# EAGLE design TidePod (EAGLE 9.0.0)
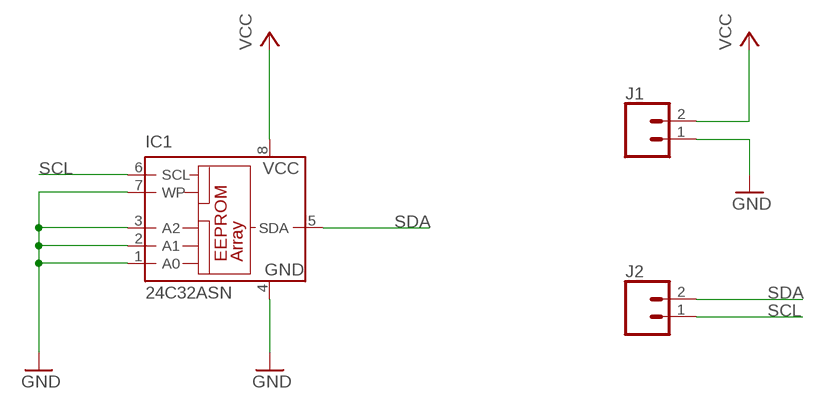
[diagram p0: schematic, sheet 1]

## Parts
IC1  24C32ASN  [SO-08]
J1  CONN_021X02_NO_SILK  [1X02_NO_SILK]
J2  CONN_021X02_NO_SILK  [1X02_NO_SILK]

## Nets
GND: IC1.1(A0) IC1.2(A1) IC1.3(A2) IC1.4(GND) IC1.7(WP) J1.1
SCL: IC1.6(SCL) J2.1
SDA: IC1.5(SDA) J2.2
VCC: IC1.8(VCC) J1.2

## Library data of the parts
IC1 = microchip:24*: Serial EEPROM I2C; MPN: IS24C32A-2GLI; OC_FARNELL: 1224413; OC_NEWARK: 43M4588
J1 J2 = SparkFun-Connectors:CONN_02: Multi connection point. Often used as Generic Header-pin footprint for 0.1 inch spaced/style header connections On any of the 0.1 inch spaced packages, you can populate with these: Break Away Headers - Straight <https://www.sparkfun.com/products/116> (PRT-00116) Break Away Male Headers - Right Angle <https://www.sparkfun.com/products/553> (PRT-00553) Female Headers <https://www.sparkfun.com/products/115> (PRT-00115) Break Away Headers - Machine Pin <https://www.sparkfun.com/products/117> (PRT-00117) Break Away Female Headers - Swiss Machine Pin <https://www.sparkfun.com/products/743> (PRT-00743) For SCREWTERMINALS and SPRING TERMINALS visit here: Screw Terimnals on SparkFun.com <https://www.sparkfun.com/search/results?term=Screw+Terminals> (5mm/3.5mm/2.54mm spacing) This device is also useful as a general connection point to wire up your design to another part of your project. Our various solder wires solder well into these plated through hole pads. Hook-Up Wire - Assortment (Stranded, 22 AWG) <https://www.sparkfun.com/products/11375> (PRT-11375) Hook-Up Wire - Assortment (Solid Core, 22 AWG) <https://www.sparkfun.com/products/11367> (PRT-11367) View the entire wire category on our website here <https://www.sparkfun.com/categories/141> Special notes: Molex polarized connector foot print use with: PRT-08233 with associated crimp pins and housings. 2.54_SCREWTERM for use with PRT-10571. 3.5mm Screw Terminal footprints for PRT-08084 5mm Screw Terminal footprints for use with PRT-08432

## Board
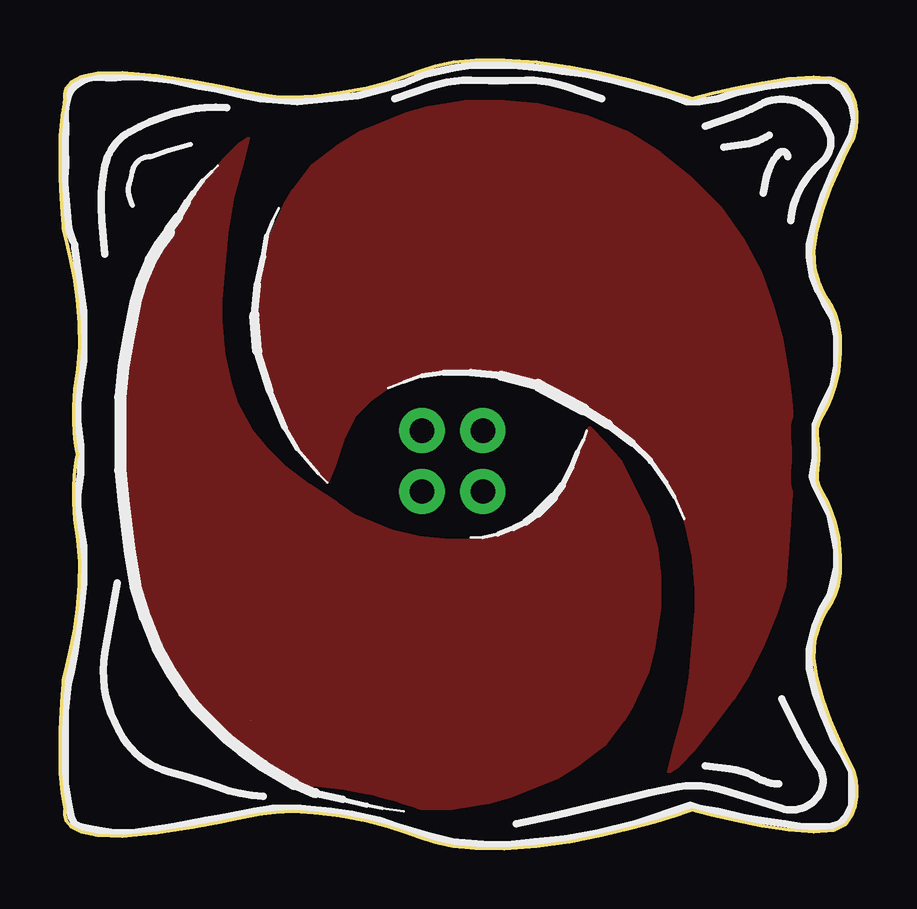
[diagram p1: board, top side]
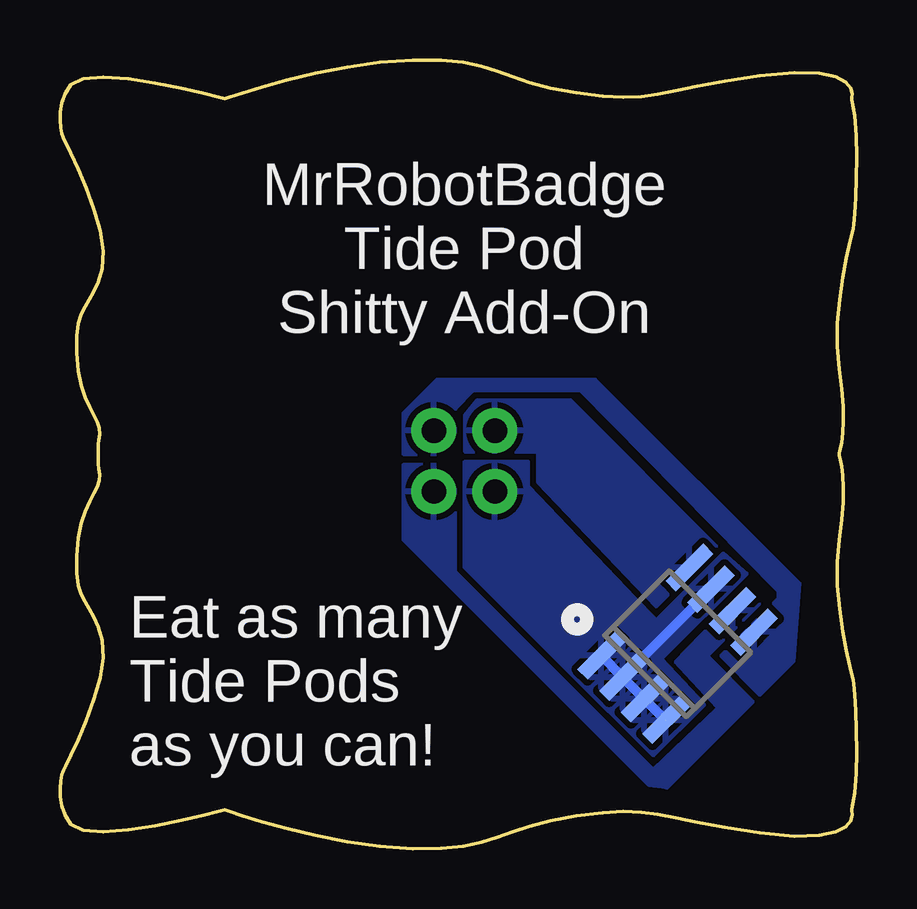
[diagram p2: board, bottom side, seen from below]

Size 33.2 x 32.88 mm. Coordinates in mm from the lower left corner, seen from the top.
Outline: 31.6,16.44 31.6,16.45 31.61,16.47 31.61,16.52 31.61,16.6 31.61,16.71 31.6,16.85 31.58,17.04 31.55,17.28 31.56,17.53 31.64,17.79 31.79,18.08 31.96,18.41 32.14,18.82 32.31,19.31 32.44,19.92 32.51,20.67 32.5,21.38 32.43,21.9 32.31,22.29 32.15,22.6 31.97,22.89 31.79,23.22 31.61,23.63 31.45,24.19 31.4,24.92 31.53,25.77 31.78,26.66 32.1,27.54 32.44,28.34 32.75,28.99 32.97,29.42 33.05,29.59 33.07,29.64 33.12,29.8 33.17,30.05 33.2,30.36 33.19,30.71 33.13,31.09 32.99,31.48 32.74,31.85 32.24,32.11 31.4,32.17 30.36,32.09 29.24,31.92 28.15,31.71 27.22,31.49 26.58,31.33 26.34,31.27 26.15,31.33 25.62,31.5 24.8,31.75 23.76,32.03 22.56,32.32 21.24,32.58 19.87,32.78 18.5,32.88 17.32,32.87 16.39,32.78 15.64,32.62 14.99,32.42 14.34,32.18 13.63,31.94 12.77,31.71 11.68,31.51 10.59,31.37 9.72,31.33 8.99,31.36 8.29,31.45 7.54,31.6 6.64,31.78 5.51,31.99 4.04,32.22 2.6,32.35 1.57,32.33 0.88,32.18 0.47,31.96 0.26,31.71 0.19,31.48 0.2,31.3 0.22,31.24 0.09,30.55 0.02,29.73 0,28.84 0.01,27.95 0.05,27.14 0.09,26.47 0.13,26.01 0.14,25.85 0.18,25.69 0.29,25.27 0.43,24.62 0.58,23.81 0.72,22.89 0.81,21.92 0.82,20.93 0.74,20 0.63,19.16 0.57,18.44 0.57,17.83 0.59,17.33 0.63,16.94 0.68,16.66 0.72,16.5 0.74,16.44 0.72,16.39 0.68,16.22 0.63,15.94 0.59,15.55 0.57,15.05 0.57,14.44 0.63,13.72 0.74,12.88 0.82,11.95 0.81,10.97 0.72,9.99 0.58,9.07 0.43,8.26 0.29,7.61 0.18,7.19 0.14,7.03 0.13,6.87 0.09,6.41 0.05,5.75 0.01,4.93 0,4.04 0.02,3.15 0.09,2.33 0.22,1.65 0.2,1.58 0.19,1.41 0.26,1.17 0.47,0.92 0.88,0.7 1.57,0.56 2.6,0.53 4.04,0.66 5.51,0.89 6.64,1.1 7.54,1.28 8.29,1.43 8.99,1.52 9.72,1.55 10.59,1.51 11.68,1.37 12.77,1.17 13.63,0.94 14.34,0.7 14.99,0.47 15.64,0.26 16.39,0.1 17.32,0.01 18.5,0 19.87,0.1 21.24,0.3 22.56,0.56 23.76,0.85 24.8,1.13 25.62,1.38 26.15,1.55 26.34,1.61 26.58,1.55 27.22,1.39 28.15,1.18 29.24,0.96 30.36,0.79 31.4,0.71 32.24,0.78 32.74,1.03 32.99,1.4 33.13,1.79 33.19,2.17 33.2,2.52 33.17,2.83 33.12,3.08 33.07,3.24 33.05,3.3 32.97,3.46 32.75,3.9 32.44,4.55 32.1,5.34 31.78,6.22 31.53,7.12 31.4,7.96 31.45,8.69 31.61,9.25 31.79,9.66 31.97,9.99 32.15,10.28 32.31,10.59 32.43,10.98 32.5,11.51 32.51,12.21 32.44,12.96 32.31,13.57 32.14,14.07 31.96,14.47 31.79,14.8 31.64,15.09 31.56,15.35 31.55,15.61 31.58,15.84 31.6,16.03 31.61,16.17 31.61,16.28 31.61,16.36 31.61,16.41 31.6,16.43 31.6,16.44
Copper layers (1*16): Top 0.035mm / dielectric 1.5mm / Bottom 0.035mm
Design rules "default": minimum track width 6mil, minimum drill 0.35mm, track to track 6mil, track to pad 6mil, pad to pad 6mil, via to via 6mil, smd to smd 6mil, copper to edge 40mil, drill to drill 6mil, minimum pad ring 10mil, minimum via ring 8mil, stop-mask expansion 4mil, vias tented up to drill 0mil, thermal gap 10mil
Milling: 208 lines

### Footprints (pad centres in the part's own frame; a part is rotated, then mirrored left to right if it is on the bottom)
SO-08 = smd 0.6 x 2.2: 1 -1.905,-2.6; 2 -0.635,-2.6; 3 0.635,-2.6; 4 1.905,-2.6; 5 1.905,2.6; 6 0.635,2.6; 7 -0.635,2.6; 8 -1.905,2.6
1X02_NO_SILK = drill 1.016 pad 1.88: 1 0,0; 2 2.54,0

### Placement (x,y rotation side)
IC1  7.46,8.54 315 bottom
J1  15.08,14.89 90 top
J2  17.62,14.89 90 top

### Tracks (layer width: path | path; a pad name or v marks a point on that pad's centre or on a via)
GND  (1 unrouted)
  Bottom 0.406: IC1.4 IC1.3 IC1.2 | IC1.2 IC1.1 | IC1.7 IC1.2
  pour Bottom: 5.56,12.35 8.35,9.56 9.24,10.45 12.16,7.52 8.48,3.84 6.32,6 8.1,7.91 4.54,11.46
  pour Bottom: 12.16,7.52 16.35,11.72 16.35,16.16 13.69,16.16 13.69,15.14 9.24,10.45
N$1
  pour Top: 22.07,17.56 22.7,16.92 23.34,16.16 23.97,14.89 24.48,13.87 24.86,12.48 24.99,11.33 24.99,10.06 24.73,8.41 24.48,7.4 23.85,6 23.46,5.37 22.7,4.35 21.69,3.59 20.67,2.95 18.77,2.19 17.88,1.94 16.35,1.68 14.7,1.68 13.3,1.81 11.27,2.32 9.62,2.95 8.22,3.84 6.95,4.86 6.19,5.62 5.68,6.13 4.8,7.4 4.03,8.79 3.53,10.19 3.14,11.59 2.89,13.11 2.76,14.13 2.64,15.65 2.64,17.18 2.76,18.32 2.89,20.22 3.02,21.88 3.4,23.02 3.91,24.29 4.54,25.56 5.18,26.57 5.94,27.59 6.83,28.73 7.46,29.37 7.84,29.62 7.59,28.61 7.21,27.21 6.95,25.69 6.83,24.29 6.7,22.89 6.7,22 6.83,20.61 7.08,19.46 7.34,18.57 7.97,17.43 8.61,16.67 9.37,15.91 10.38,15.14 11.53,14.38 12.29,13.87 13.81,13.24 14.96,12.99 16.23,12.86 17.24,12.86 18.38,13.11 19.4,13.49 20.29,14.13 20.92,14.76 21.43,15.78 21.81,16.92
N$2
  pour Top: 11.15,15.27 10.51,15.91 9.88,16.67 8.73,18.95 8.35,20.35 8.22,21.49 8.22,22.76 8.48,24.42 8.73,25.43 9.37,26.83 9.75,27.46 10.51,28.48 11.53,29.24 12.54,29.88 14.45,30.64 15.34,30.89 16.86,31.15 18.51,31.15 19.91,31.02 21.94,30.51 23.59,29.88 24.99,28.99 26.26,27.97 27.53,26.7 28.42,25.43 29.18,24.03 29.69,22.64 30.07,21.24 30.32,19.72 30.45,18.7 30.58,17.18 30.58,15.65 30.45,14.51 30.32,12.6 30.2,10.95 29.81,9.81 29.31,8.54 28.67,7.27 28.04,6.25 27.27,5.24 26.39,4.1 25.75,3.46 25.37,3.21 25.62,4.22 26,5.62 26.26,7.14 26.51,9.94 26.51,10.83 26.39,12.22 26.13,13.37 25.88,14.26 25.24,15.4 24.61,16.16 23.85,16.92 22.83,17.68 20.92,18.95 19.4,19.59 18.26,19.84 16.99,19.97 15.97,19.97 14.83,19.72 13.81,19.34 12.92,18.7 12.29,18.07 11.78,17.05 11.4,15.91
SCL
  pour Bottom: 4.29,11.21 3.65,10.57 6.19,8.03 4.29,6.13 8.22,2.19 18.89,12.86 18.89,16.03 16.73,16.03 16.73,11.59 8.48,3.33 5.81,5.87 7.59,7.78
SDA
  Bottom 0.406: 18.13,17.43 J2.2
  pour Bottom: 18.89,16.41 18.89,18.19 17.5,19.59 10.89,19.59 2.38,11.08 2.64,7.78 4.03,6.38 5.68,8.03 3.27,10.45 3.27,10.7 11.53,19.08 15.97,19.08 16.73,18.32 16.73,16.41
VCC
  pour Bottom: 5.81,12.6 11.91,18.7 15.84,18.7 16.35,18.07 16.35,16.54 13.3,16.54 13.3,15.27 8.35,10.06

### Text on the board
bPlace: MrRobotBadge / Tide Pod / Shitty Add-On | Eat as many / Tide Pods / as you can!